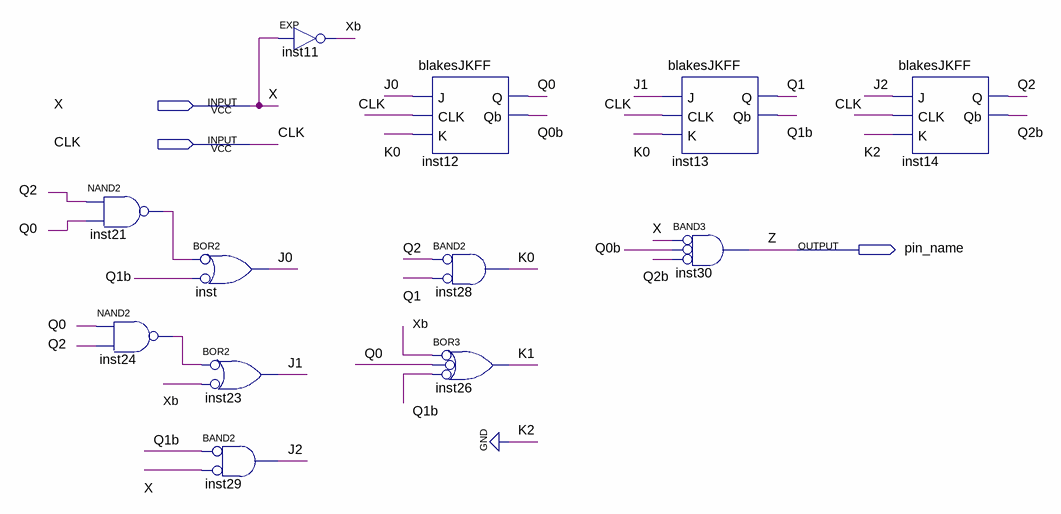
[diagram p0: schematic sheet]
// Quartus schematic lab2.bdf as structural Verilog: 12 symbols, 3 pins
module lab2 (
  input  X,
  input  CLK,
  output pin_name
);

  wire inst21_out, inst24_out, J0, J1, J2, K0, K1, Q0, Q0b, Q1, Q1b, Q2, Q2b, Xb;

  nand inst21 (inst21_out, Q2, Q0);
  nand inst24 (inst24_out, Q0, Q2);
  or inst (J0, ~inst21_out, ~Q1b);  // BOR2
  or inst23 (J1, ~inst24_out, ~Xb);  // BOR2
  and inst29 (J2, ~Q1b, ~X);  // BAND2
  EXP inst11 (.IN(X), .OUT(Xb));
  blakesJKFF inst12 (.J(J0), .CLK(CLK), .K(K0), .Q(Q0), .Qb(Q0b));
  and inst28 (K0, ~Q2, ~Q1);  // BAND2
  or inst26 (K1, ~Xb, ~Q0, ~Q1b);  // BOR3
  blakesJKFF inst13 (.J(J1), .CLK(CLK), .K(K0), .Q(Q1), .Qb(Q1b));
  and inst30 (pin_name, ~X, ~Q0b, ~Q2b);  // BAND3
  blakesJKFF inst14 (.J(J2), .CLK(CLK), .K(1'b0), .Q(Q2), .Qb(Q2b));

  // Other names for the same wires on the sheet: Z = pin_name
endmodule
